# EAGLE design Fubarino_SD_v12 (EAGLE 5.10)
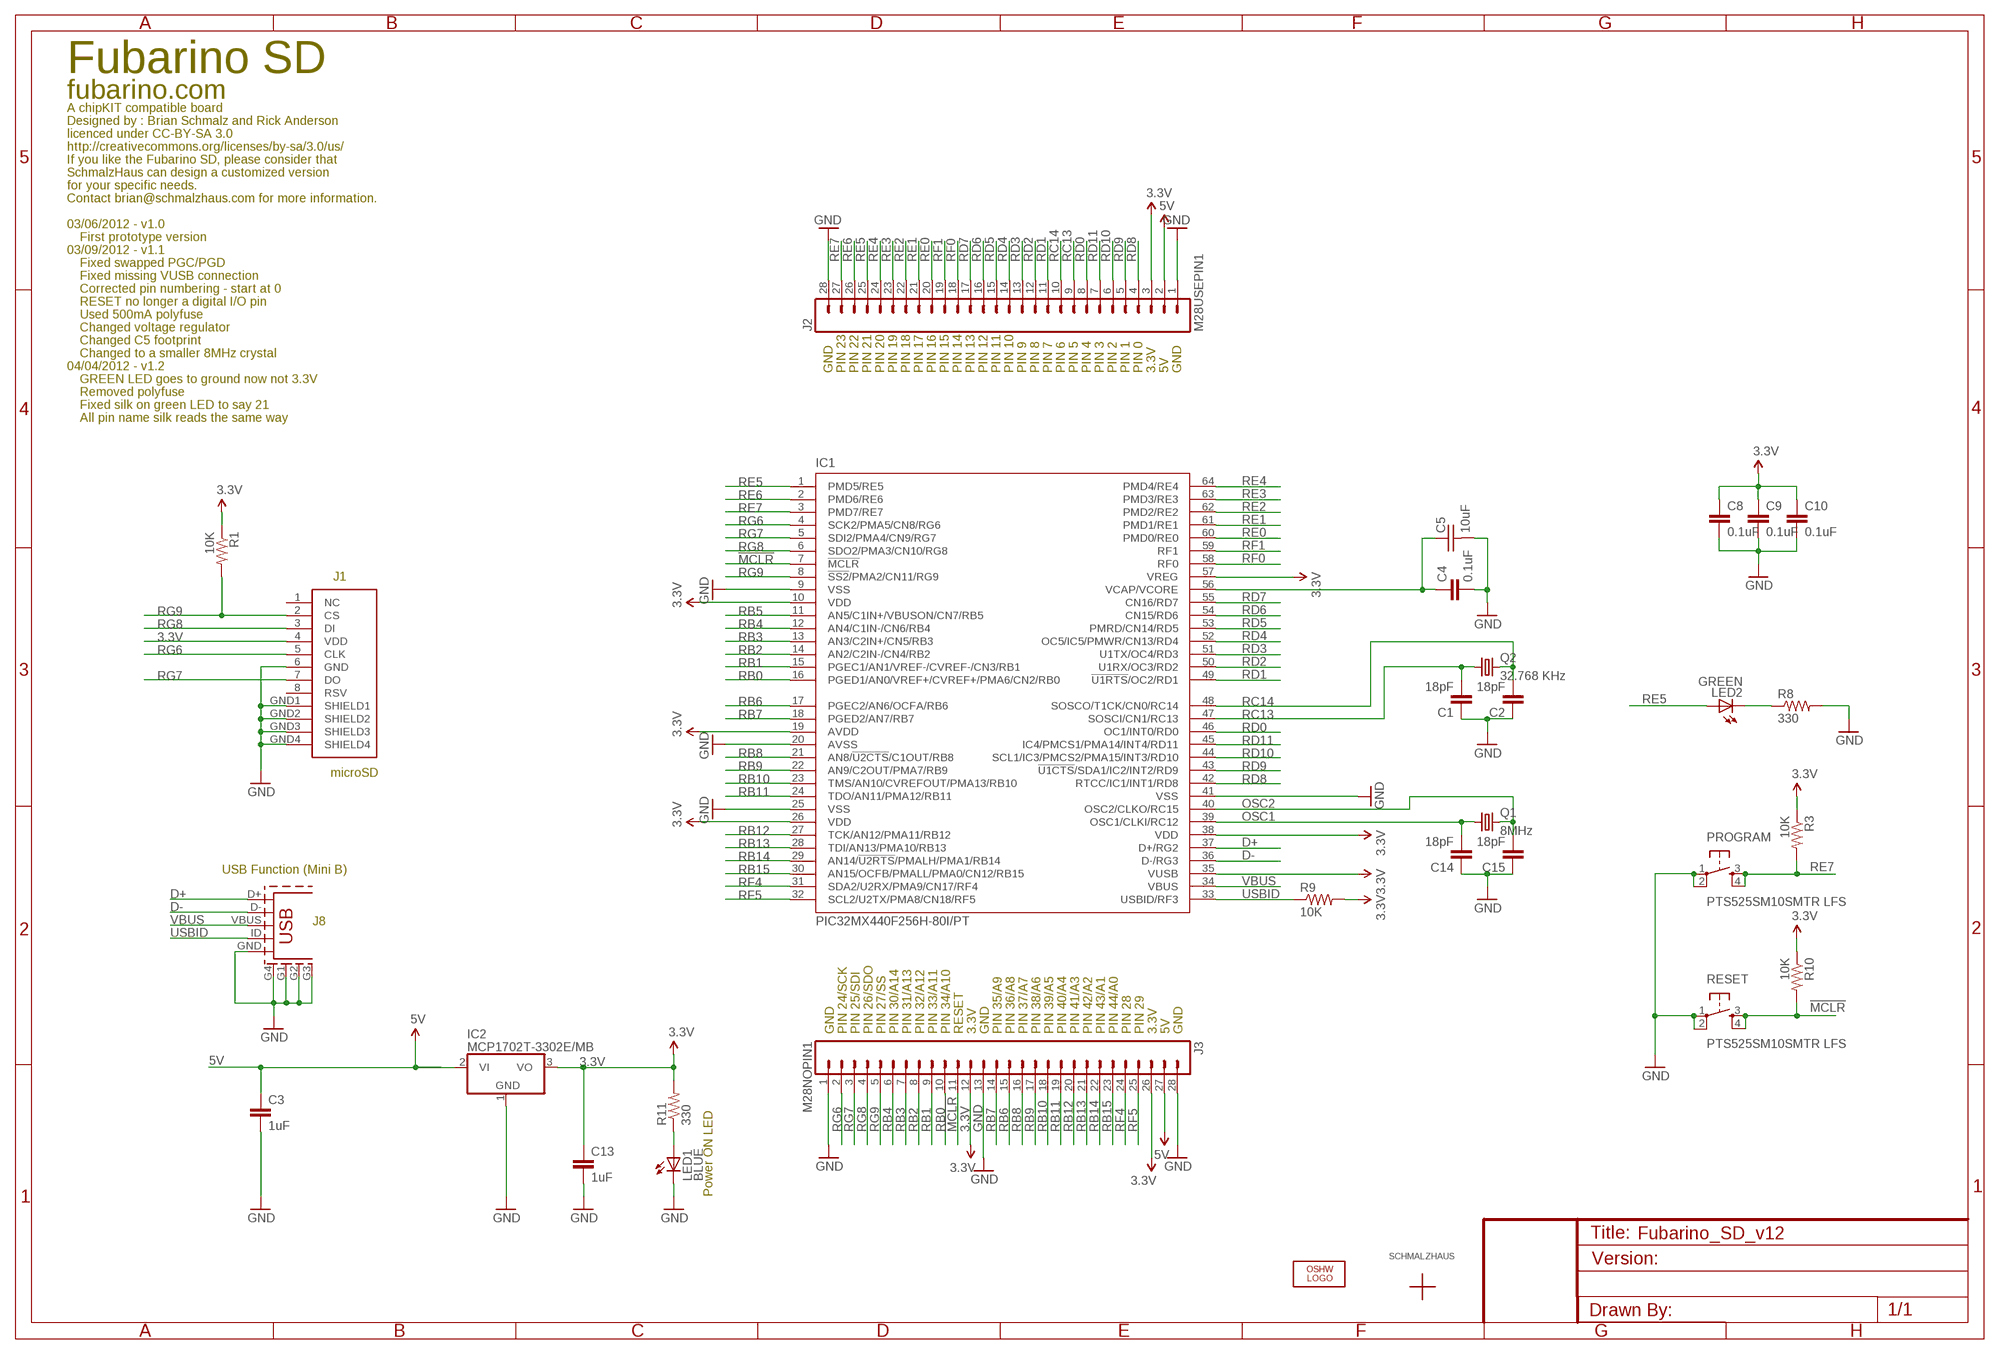
[diagram p0: schematic, sheet 1]

## Parts
C1  18pF  CAP0603-CAP  [0603-CAP]
C2  18pF  CAP0603-CAP  [0603-CAP]
C3  1uF  CAP0603-CAP  [0603-CAP]
C4  0.1uF  CAP0603-CAP  [0603-CAP]
C5  10uF  CAP0805  [CAP_0805]
C8  0.1uF  CAP0603-CAP  [0603-CAP]
C9  0.1uF  CAP0603-CAP  [0603-CAP]
C10  0.1uF  CAP0603  [0603]
C13  1uF  CAP0603  [0603]
C14  18pF  CAP0603-CAP  [0603-CAP]
C15  18pF  CAP0603-CAP  [0603-CAP]
IC1  PIC32MX440F256H-80I/PT  PIC32MX440F256H  [TQFP64-10X10]
IC2  MCP1702T-3302E/MB  MCP170333MB  [SOT89]
J1  MICRO_SD_CARD_SOCKET  [SD-MMC_SOCKET-PP]
J2  M28USEPIN1  [1X28]
J3  M28NOPIN1  [1X28_NO_PIN_1]
J8  UX60A-MB-5ST  USB_5PIN  [USB-MINIB]
LED1  BLUE  LED0603  [LED-0603]
LED2  GREEN  LED0603  [LED-0603]
LOGO1  OSHW_LOGO_8MILX0070-NT  [OSHW_8X70_NOTEXT]
PROGRAM  PTS525SM10SMTR LFS  TAC_SWITCHSND  [TACTILE_SWITCH_SMD]
Q1  8MHz  CRYSTALNX5032  [NX5032_5MM_3.2MM_CRYSTAL]
Q2  32.768 KHz  CRYSTALTC26H  [TC26H]
R1  10K  RESISTOR0603-RES  [0603-RES]
R3  10K  RESISTOR0603-RES  [0603-RES]
R8  330  RESISTOR0603-RES  [0603-RES]
R9  10K  RESISTOR0603-RES  [0603-RES]
R10  10K  RESISTOR0603-RES  [0603-RES]
R11  330  RESISTOR0603-RES  [0603-RES]
RESET  PTS525SM10SMTR LFS  TAC_SWITCHSND  [TACTILE_SWITCH_SMD]
U$1  SCHMALZHAUSSCHMALZHAUS_SMALL  [SCHMALZHAUS_SMALL]

## Nets
3.3V: C8.1 C9.1 C10.1 C13.1 IC1.10(VDD) IC1.19(AVDD) IC1.26(VDD) IC1.35(VUSB) IC1.38(VDD) IC1.57(VREG) IC2.3(VO) J1.4(VDD) J2.3 J3.12 J3.26 R1.1 R3.1 R9.2 R10.1 R11.2
5V: C3.1 IC2.2(VI) IC2.2@1(VI1) J2.2 J3.27
!MCLR!: IC1.7(!MCLR) J3.11 R10.2 RESET.3 RESET.4
D+: IC1.37(D+/RG2) J8.D+
D-: IC1.36(D-/RG3) J8.D-
GND: C1.1 C2.1 C3.2 C4.2 C5.2 C8.2 C9.2 C10.2 C13.2 C14.1 C15.1 IC1.9(VSS) IC1.20(AVSS) IC1.25(VSS) IC1.41(VSS) IC2.1(GND) J1.6(GND) J1.GND1(SHIELD1) J1.GND2(SHIELD2) J1.GND3(SHIELD3) J1.GND4(SHIELD4) J2.1 J2.28 J3.1 J3.13 J3.28 J8.G1 J8.G2 J8.G3 J8.G4(SHIELD) J8.GND LED1.C PROGRAM.1 PROGRAM.2 R8.2 RESET.1 RESET.2
N$6: LED1.A R11.1
N$20: LED2.C R8.1
N$110: C4.1 C5.1 IC1.56(VCAP/VCORE)
OSC1: C14.2 IC1.39(OSC1/CLKI/RC12) Q1.1
OSC2: C15.2 IC1.40(OSC2/CLKO/RC15) Q1.2
RB0: IC1.16(PGED1/AN0/VREF+/CVREF+/PMA6/CN2/RB0) J3.10
RB1: IC1.15(PGEC1/AN1/VREF-/CVREF-/CN3/RB1) J3.9
RB2: IC1.14(AN2/C2IN-/CN4/RB2) J3.8
RB3: IC1.13(AN3/C2IN+/CN5/RB3) J3.7
RB4: IC1.12(AN4/C1IN-/CN6/RB4) J3.6
RB5: IC1.11(AN5/C1IN+/VBUSON/CN7/RB5)
RB6: IC1.17(PGEC2/AN6/OCFA/RB6) J3.15
RB7: IC1.18(PGED2/AN7/RB7) J3.14
RB8: IC1.21(AN8/!U2CTS!/C1OUT/RB8) J3.16
RB9: IC1.22(AN9/C2OUT/PMA7/RB9) J3.17
RB10: IC1.23(TMS/AN10/CVREFOUT/PMA13/RB10) J3.18
RB11: IC1.24(TDO/AN11/PMA12/RB11) J3.19
RB12: IC1.27(TCK/AN12/PMA11/RB12) J3.20
RB13: IC1.28(TDI/AN13/PMA10/RB13) J3.21
RB14: IC1.29(AN14/!U2RTS!/PMALH/PMA1/RB14) J3.22
RB15: IC1.30(AN15/OCFB/PMALL/PMA0/CN12/RB15) J3.23
RC13: C1.2 IC1.47(SOSCI/CN1/RC13) J2.9 Q2.1
RC14: C2.2 IC1.48(SOSCO/T1CK/CN0/RC14) J2.10 Q2.2
RD0: IC1.46(OC1/INT0/RD0) J2.8
RD1: IC1.49(!U1RTS!/OC2/RD1) J2.11
RD2: IC1.50(U1RX/OC3/RD2) J2.12
RD3: IC1.51(U1TX/OC4/RD3) J2.13
RD4: IC1.52(OC5/IC5/PMWR/CN13/RD4) J2.14
RD5: IC1.53(PMRD/CN14/RD5) J2.15
RD6: IC1.54(CN15/RD6) J2.16
RD7: IC1.55(CN16/RD7) J2.17
RD8: IC1.42(RTCC/IC1/INT1/RD8) J2.4
RD9: IC1.43(!U1CTS!/SDA1/IC2/INT2/RD9) J2.5
RD10: IC1.44(SCL1/IC3/PMCS2/PMA15/INT3/RD10) J2.6
RD11: IC1.45(IC4/PMCS1/PMA14/INT4/RD11) J2.7
RE0: IC1.60(PMD0/RE0) J2.20
RE1: IC1.61(PMD1/RE1) J2.21
RE2: IC1.62(PMD2/RE2) J2.22
RE3: IC1.63(PMD3/RE3) J2.23
RE4: IC1.64(PMD4/RE4) J2.24
RE5: IC1.1(PMD5/RE5) J2.25 LED2.A
RE6: IC1.2(PMD6/RE6) J2.26
RE7: IC1.3(PMD7/RE7) J2.27 PROGRAM.3 PROGRAM.4 R3.2
RF0: IC1.58(RF0) J2.18
RF1: IC1.59(RF1) J2.19
RF4: IC1.31(SDA2/U2RX/PMA9/CN17/RF4) J3.24
RF5: IC1.32(SCL2/U2TX/PMA8/CN18/RF5) J3.25
RG6: IC1.4(SCK2/PMA5/CN8/RG6) J1.5(CLK) J3.2
RG7: IC1.5(SDI2/PMA4/CN9/RG7) J1.7(DO) J3.3
RG8: IC1.6(SDO2/PMA3/CN10/RG8) J1.3(DI) J3.4
RG9: IC1.8(!SS2!/PMA2/CN11/RG9) J1.2(CS) J3.5 R1.2
USBID: IC1.33(USBID/RF3) J8.ID(USB_ID) R9.1
VBUS: IC1.34(VBUS) J8.VBUS
Unconnected: J1.1(NC) J1.8(RSV)

## Notes on the sheet
- Fubarino SD
- fubarino.com
- A chipKIT compatible board
- Designed by : Brian Schmalz and Rick Anderson
- licenced under CC-BY-SA 3.0
- http://creativecommons.org/licenses/by-sa/3.0/us/
- If you like the Fubarino SD, please consider that
- SchmalzHaus can design a customized version
- for your specific needs.
- Contact brian@schmalzhaus.com for more information.
- 03/06/2012 - v1.0
- First prototype version
- 03/09/2012 - v1.1
- Fixed swapped PGC/PGD
- Fixed missing VUSB connection
- Corrected pin numbering - start at 0
- RESET no longer a digital I/O pin
- Used 500mA polyfuse
- Changed voltage regulator
- Changed C5 footprint
- Changed to a smaller 8MHz crystal
- 04/04/2012 - v1.2 | GND | PIN 23 | PIN 22 | PIN 21 | PIN 20 | PIN 19 | PIN 18 | PIN 17 | PIN 16 | PIN 15 | PIN 14 | PIN 13 | PIN 12 | PIN 11 | PIN 10 | PIN 9 | PIN 8 | PIN 7 | PIN 6 | PIN 5 | PIN 4 | PIN 3 | PIN 2 | PIN 1 | PIN 0 | 3.3V | 5V | GND
- GREEN LED goes to ground now not 3.3V
- Removed polyfuse
- Fixed silk on green LED to say 21
- All pin name silk reads the same way
- J1
- microSD
- USB Function (Mini B)
- J8
- GND | PIN 24/SCK | PIN 25/SDI | PIN 26/SDO | PIN 27/SS | PIN 30/A14 | PIN 31/A13 | PIN 32/A12 | PIN 33/A11 | PIN 34/A10 | RESET | 3.3V | GND | PIN 35/A9 | PIN 36/A8 | PIN 37/A7 | PIN 38/A6 | PIN 39/A5 | PIN 40/A4 | PIN 41/A3 | PIN 42/A2 | PIN 43/A1 | PIN 44/A0 | PIN 28 | PIN 29 | 3.3V | 5V | GND
- Power ON LED

## Library data of the parts
C1-C4 C8 C9 C14 C15 = SparkFun:CAP: Capacitor Standard 0603 ceramic capacitor, and 0.1" leaded capacitor.
C5 = SchmalzHaus:CAP
C10 C13 = SparkFun02-20-08:CAP: Capacitor Standard 0603 ceramic capacitor, and 0.1" leaded capacitor.
IC1 = SchmalzHaus:PIC32MX440F256H: PIC32MX440F256H edit this description Auto generated by make-symbol-device-package-bsdl.ulp Rev. 25 Source: PIC32MX440F256H.bsdl
IC2 = linear:MCP1703*: 250 mA, 16V, Low Quiescent Current LDO Regulator Source: http://ww1.microchip.com/downloads/en/DeviceDoc/22049b.pdf
J1 = SchmalzHaus:MICRO_SD_CARD_SOCKET: SD/MMC Socket Media socket for SD and MMC cards. Push-push type. Schematic element and footprint production proven. Spark Fun Electronics SKU : PRT-00136
J2 J3 = SchmalzHaus:M28
J8 = SparkFun02-20-08:USB_5PIN
LED1 LED2 = SparkFun:LED: LEDs Standard schematic elements and footprints for 5mm, 3mm, 1206, and 0603 sized LEDs. 5mm - Spark Fun Electronics SKU : COM-00529 (and others)
LOGO1 = OSHW:OSHW_LOGO_8MIL
PROGRAM RESET = SparkFun02-20-08:TAC_SWITCH: Momentary Switch Button commonly used for reset or general input. Spark Fun Electronics SKU : COM-00097
Q1 = SchmalzHaus:CRYSTAL: Crystals Various standard crystals. Proven footprints. Spark Fun Electronics SKU : COM-00534
Q2 = SparkFun-12-01-09:CRYSTAL: Crystals Various standard crystals. Proven footprints. Spark Fun Electronics SKU : COM-00534
R1 R3 R8-R11 = SparkFun:RESISTOR: Resistor Basic schematic elements and footprints for 0603, 1206, and PTH resistors.
U$1 = SchmalzHaus:SCHMALZHAUS

## Board
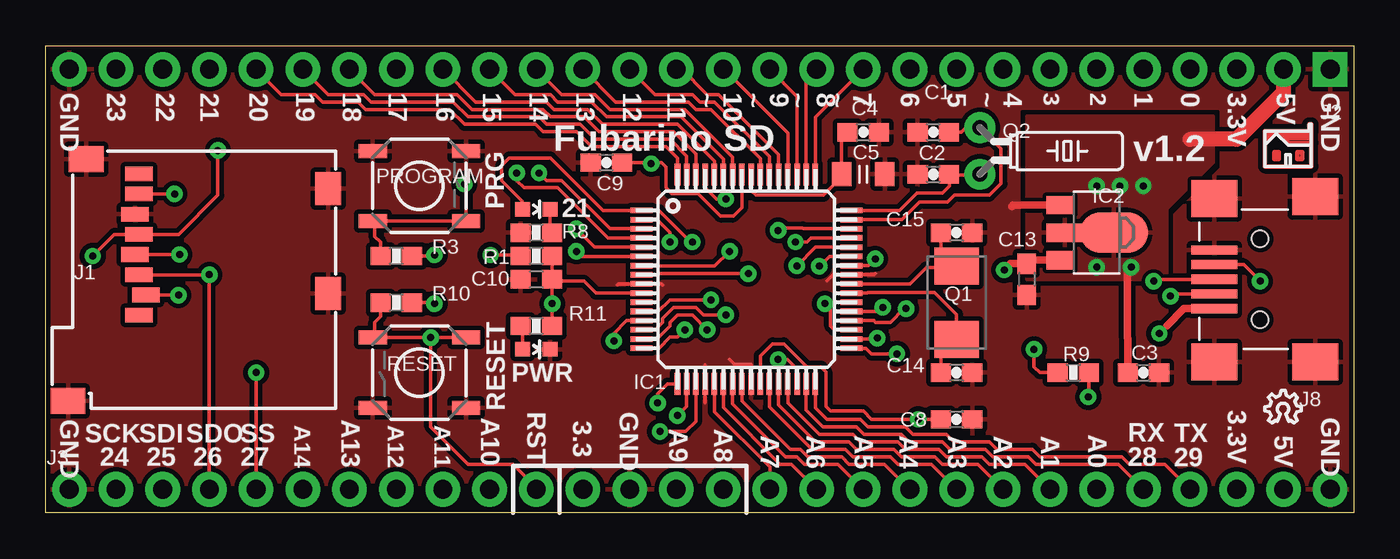
[diagram p1: board, top side]
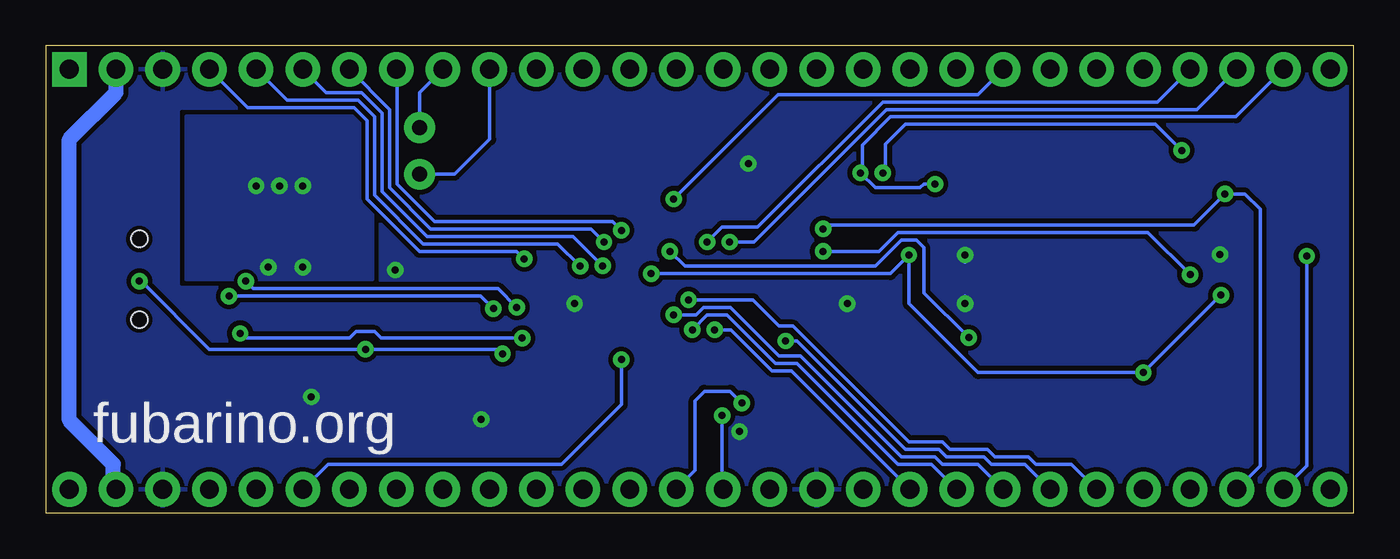
[diagram p2: board, bottom side, seen from below]

Size 71.12 x 25.4 mm. Coordinates in mm from the lower left corner, seen from the top.
Outline: 0,25.4 71.12,25.4 71.12,0 0,0 0,25.4
Copper layers (1*16): Top 0.035mm / dielectric 1.5mm / Bottom 0.035mm
Design rules "GoldPhoenix_8and8": minimum track width 7mil, minimum drill 15mil, track to track 8mil, track to pad 8mil, pad to pad 8mil, via to via 8mil, smd to smd 8mil, copper to edge 10mil, drill to drill 8mil, minimum pad ring 12mil, minimum via ring 10mil, stop-mask expansion 4mil, vias tented up to drill 25mil, thermal gap 10mil

### Footprints (pad centres in the part's own frame; a part is rotated, then mirrored left to right if it is on the bottom)
0603-CAP = smd 1.1 x 1: 1 -0.85,0; 2 0.85,0
CAP_0805 = smd 1.05 x 1.3: 1 -1.175,0; 2 1.175,0
0603 = smd 1.1 x 1: 1 -0.85,0; 2 0.85,0
TQFP64-10X10 = smd 1.2 x 0.3: 1 -5.7,3.75; 2 -5.7,3.25; 3 -5.7,2.75; 4 -5.7,2.25; 5 -5.7,1.75; 6 -5.7,1.25; 7 -5.7,0.75; 8 -5.7,0.25; 9 -5.7,-0.25; 10 -5.7,-0.75; 11 -5.7,-1.25; 12 -5.7,-1.75; 13 -5.7,-2.25; 14 -5.7,-2.75; 15 -5.7,-3.25; 16 -5.7,-3.75; 33 5.7,-3.75; 34 5.7,-3.25; 35 5.7,-2.75; 36 5.7,-2.25; 37 5.7,-1.75; 38 5.7,-1.25; 39 5.7,-0.75; 40 5.7,-0.25; 41 5.7,0.25; 42 5.7,0.75; 43 5.7,1.25; 44 5.7,1.75; 45 5.7,2.25; 46 5.7,2.75; 47 5.7,3.25; 48 5.7,3.75 | smd 0.3 x 1.2: 17 -3.75,-5.7; 18 -3.25,-5.7; 19 -2.75,-5.7; 20 -2.25,-5.7; 21 -1.75,-5.7; 22 -1.25,-5.7; 23 -0.75,-5.7; 24 -0.25,-5.7; 25 0.25,-5.7; 26 0.75,-5.7; 27 1.25,-5.7; 28 1.75,-5.7; 29 2.25,-5.7; 30 2.75,-5.7; 31 3.25,-5.7; 32 3.75,-5.7; 49 3.75,5.7; 50 3.25,5.7; 51 2.75,5.7; 52 2.25,5.7; 53 1.75,5.7; 54 1.25,5.7; 55 0.75,5.7; 56 0.25,5.7; 57 -0.25,5.7; 58 -0.75,5.7; 59 -1.25,5.7; 60 -1.75,5.7; 61 -2.25,5.7; 62 -2.75,5.7; 63 -3.25,5.7; 64 -3.75,5.7
SOT89 = smd 1 x 1.5: 1 -1.499,-1.981; 3 1.499,-1.981 | smd 1 x 2: 2 0,-1.727 | smd 2.2 x 3.7: 2@1 0,0.94
SD-MMC_SOCKET-PP = smd 0.8 x 1.5: 1 -8.94,10.7; 2 -7.84,10.3; 3 -6.74,10.7; 4 -5.64,10.9; 5 -4.54,10.7; 6 -3.44,10.9; 7 -2.34,10.7; 8 -1.24,10.7 | smd 1.4 x 1.9: GND1 -13.6,14.55; GND2 -0.45,13.55 | smd 1.8 x 1.4: GND3 -7.75,0.4; GND4 -2.05,0.4
1X28 = drill 1.016 pad 1.88 square: 1 0,0 | drill 1.016 pad 1.88 round: 2 2.54,0; 3 5.08,0; 4 7.62,0; 5 10.16,0; 6 12.7,0; 7 15.24,0; 8 17.78,0; 9 20.32,0; 10 22.86,0; 11 25.4,0; 12 27.94,0; 13 30.48,0; 14 33.02,0; 15 35.56,0; 16 38.1,0; 17 40.64,0; 18 43.18,0; 19 45.72,0; 20 48.26,0; 21 50.8,0; 22 53.34,0; 23 55.88,0; 24 58.42,0; 25 60.96,0; 26 63.5,0; 27 66.04,0; 28 68.58,0
1X28_NO_PIN_1 = drill 1.016 pad 1.88 round: 1 0,0; 2 2.54,0; 3 5.08,0; 4 7.62,0; 5 10.16,0; 6 12.7,0; 7 15.24,0; 8 17.78,0; 9 20.32,0; 10 22.86,0; 11 25.4,0; 12 27.94,0; 13 30.48,0; 14 33.02,0; 15 35.56,0; 16 38.1,0; 17 40.64,0; 18 43.18,0; 19 45.72,0; 20 48.26,0; 21 50.8,0; 22 53.34,0; 23 55.88,0; 24 58.42,0; 25 60.96,0; 26 63.5,0; 27 66.04,0; 28 68.58,0
USB-MINIB = smd 2.5 x 0.5: D+ 2.5,0; D- 2.5,0.8; GND 2.5,-1.6; ID 2.5,-0.8; VBUS 2.5,1.6 | smd 2.5 x 2: G1 -3,4.5; G2 2.5,4.5; G3 -3,-4.5; G4 2.5,-4.4 | hole 0.9: 0,2.2; 0,-2.2
LED-0603 = smd 0.8 x 0.8: A 0,-0.75; C 0,0.75
TACTILE_SWITCH_SMD = smd 1.524 x 0.762: 1 -2.54,1.905; 2 2.54,1.905; 3 -2.54,-1.905; 4 2.54,-1.905
NX5032_5MM_3.2MM_CRYSTAL = smd 2 x 2.4: 1 -2,0; 2 2,0
TC26H = drill 0.813 pad 1.676 round: 1 -1.27,0; 2 1.27,0
0603-RES = smd 1.1 x 1: 1 -0.85,0; 2 0.85,0

### Placement (x,y rotation side)
C1  48.26,20.7 0 top
C2  48.26,18.41 0 top
C3  59.69,7.62 0 top
C4  44.45,20.7 0 top
C5  44.45,18.41 0 top
C8  49.53,5.08 0 top
C9  30.48,19.05 180 top
C10  26.67,12.7 180 top
C13  53.34,12.7 270 top
C14  49.53,7.62 180 top
C15  49.53,15.24 180 top
IC1  38.1,12.7 0 top
IC2  57.15,15.24 270 top
J1  15.75,19.68 90 top
J2  69.85,24.13 180 top
J3  1.27,1.27 0 top
J8  66.04,12.7 180 top
LED1  26.67,8.89 270 top
LED2  26.67,16.51 270 top
LOGO1  66.29,4.88 0 top
PROGRAM  20.32,17.78 0 top
Q1  49.53,11.43 90 top
Q2  50.8,19.68 270 top
R1  26.67,13.97 180 top
R3  19.05,13.97 180 top
R8  26.67,15.24 180 top
R9  55.88,7.62 0 top
R10  19.05,11.43 180 top
R11  26.67,10.16 0 top
RESET  20.32,7.62 180 top
U$1  67.56,18.85 0 top

### Tracks (layer width: path | path; a pad name or v marks a point on that pad's centre or on a via)
3.3V  (via drill 0.38)
  Top 0.203: IC1.57 37.85,16.62 37.39,16.15 36.68,16.15 35.46,17.37 34.04,17.37 33.73,17.68 33.73,18.8 33.48,19.05 C9.1 | IC1.10 29.91,11.95 29.26,12.6 27.62,12.6 | 27.62,12.6 27.62,12.59 | R3.1 21.08,13.97 v21.13,14.02 | R10.1 21.08,11.43 v21.13,11.38 | J1.4 v7.26,14.04 v7.26,14.05 | 42.67,11.45 42.44,11.45 v42.37,11.38 | 42.67,11.45 IC1.38 | IC1.35 42.88,9.95 42.67,10.16 42.67,11.45 | IC1.26 38.86,7 38.86,8.53 39.52,9.2 40.13,9.2 41.4,7.92 42.16,7.92 42.42,7.67 42.42,5.79 42.67,5.54 44.45,5.54 44.91,5.08 v47.45,5.08 C8.1 | IC1.19 35.35,4.97 34.8,4.42 v33.4,4.42 | C10.1 R1.1 | C10.1 27.62,12.6 | R9.2 56.73,6.34 v56.69,6.3 | C10.1 27.53,12.69 v27.53,11.38 27.52,11.37 R11.2 | C9.1 31.38,19.1 | C9.1 32.87,19.05 v32.92,19
  Top 0.406: IC2.3 53.53,13.74 C13.1 52.46,13.55 v52.12,13.21
  Bottom 0.203: v21.13,14.02 21.13,13.61 | v21.13,11.38 21.13,11.79
  pour Bottom (isolate 0.254, rank 3): 0,0 0,25.4 71.12,25.4 71.12,0
5V  (via drill 0.38)
  Top 0.203: 58.84,9.49 58.83,9.5 | 58.83,13.16 v59.03,13.36
  Top 0.406: C3.1 58.84,9.49 | 58.83,9.5 58.83,13.16
  Top 0.813: J2.2 67.31,22.86 64.77,20.32 62.23,20.32
  Bottom 0.813: J2.2 67.31,22.86 69.85,20.32 69.85,5.03 67.46,2.64 67.46,1.42 J3.27
  other vias: 59.69,17.78 57.15,17.78 57.15,13.36 58.42,17.78
  pour Top: 63.5,21.59 53.34,21.59 53.34,12.7 60.96,12.7 60.96,16.51 63.5,19.05
  pour Bottom: 53.34,21.59 53.34,12.7 63.5,12.7 63.5,21.59
!MCLR!  (via drill 0.38)
  Top 0.203: R10.2 18.2,10.68 17.88,10.36 17.88,9.63 RESET.4 v20.93,9.53 | v37.19,14.22 36.37,13.41 33.22,13.41 33.18,13.45 IC1.7 | v20.93,9.53 RESET.3 | J3.11 26.67,1.37 25.4,2.64 22.96,2.64 20.93,4.67 v20.93,9.53
  Bottom 0.203: v37.19,14.22 36.37,13.41 26.01,13.41 24.59,14.83 23.77,14.83 23.37,14.43 23.37,11.96 v20.93,9.53
D+  (via drill 0.38)
  Top 0.203: J8.D+ 60.35,12.7 v60.25,12.6 | IC1.37 45.29,10.95 v45.52,11.18
  Bottom 0.203: v60.25,12.6 59.84,12.19 46.53,12.19 v45.52,11.18
D-  (via drill 0.38)
  Top 0.203: J8.D- 61.28,11.9 v61.16,11.79 | IC1.36 45.02,10.45 45.11,10.36 45.92,10.36 46.66,11.1 v46.79,11.1
  Bottom 0.203: v61.16,11.79 47.47,11.79 v46.79,11.1
GND
  Top 0.203: 45.11,13.01 45.06,12.95 IC1.41 42.82,12.95 42.47,12.6 | IC1.25 38.35,8.07 37.44,8.07 37.19,8.33 | 35.85,5.98 IC1.20 35.85,8.04 | 33.53,12.39 33.47,12.45 IC1.9 31.14,12.45 31.09,12.39
  Top 0.406: IC2.1 52.6,16.74 52.53,16.66
  pour Top (isolate 0.254, rank 4): 0,25.4 0,0 71.12,0 71.12,25.4
N$6
  Top 0.203: 25.82,10.06 R11.1 25.92,10.06 LED1.A
N$20
  Top 0.203: LED2.C 27.42,15.34 R8.1
N$110
  Top 0.203: IC1.56 38.35,17.53 38.61,17.27 42.29,17.27 42.93,17.91 42.93,18.07 C5.1 43.27,20.38 C4.1
OSC1
  Top 0.203: IC1.39 44.66,11.95 44.7,11.99 48.34,11.99 49.53,10.79 Q1.1 48.68,8.58 C14.2
OSC2
  Top 0.203: IC1.40 46.99,12.45 47.88,13.34 48.9,13.34 | 48.9,13.34 49.44,13.34 Q1.2 | C15.2 48.68,13.55 48.9,13.34
RB0  (via drill 0.38)
  Top 0.203: v34.75,9.96 34.35,9.56 33.94,9.56 33.33,8.95 IC1.16
  Bottom 0.203: J3.10 30.58,7.72 31.62,7.72 33.86,9.96 v34.75,9.96
RB1  (via drill 0.38)
  Top 0.203: IC1.15 33.22,9.45 33.93,10.16 33.93,10.36 34.34,10.77 35.15,10.77 v35.97,9.96
  Bottom 0.203: v35.97,9.96 35.15,10.77 34.09,10.77 31.45,8.13 30.28,8.13 24.79,2.64 22.96,2.64 J3.9
RB2  (via drill 0.38)
  Top 0.203: IC1.14 33.12,9.95 33.53,10.36 33.53,10.57 34.14,11.18 35.36,11.18 35.76,10.77 v36.98,10.77
  Bottom 0.203: v36.98,10.77 35.76,10.77 35.36,11.18 33.88,11.18 31.24,8.53 30.07,8.53 24.59,3.05 22.76,3.05 22.35,2.64 20.42,2.64 J3.8
RB3  (via drill 0.38)
  Top 0.203: IC1.13 31.58,10.45 30.89,9.75 v30.89,9.35
  Bottom 0.203: J3.7 17.88,2.64 19.71,2.64 20.12,3.05 22.15,3.05 22.55,3.45 24.38,3.45 30.28,9.35 v30.89,9.35
RB4  (via drill 0.38)
  Top 0.203: IC1.12 33.3,10.95 33.93,11.58 v36.17,11.58
  Bottom 0.203: v36.17,11.58 32.66,11.58 31.24,10.16 30.48,10.16 24.18,3.86 22.35,3.86 21.95,3.45 19.91,3.45 19.51,3.05 17.68,3.05 17.27,2.64 15.34,2.64 J3.6
RB6  (via drill 0.38)
  Top 0.203: IC1.17 33.8,7 33.27,6.48 v33.27,5.97
  Bottom 0.203: J3.15 36.83,1.29 35.81,2.31 35.81,6.1 35.31,6.6 33.91,6.6 v33.27,5.97
RB7  (via drill 0.38)
  Top 0.203: IC1.18 34.85,5.79 v34.34,5.28
  Bottom 0.203: v34.34,5.28 34.34,1.32 J3.14
RB8
  Top 0.203: IC1.21 36.35,5.51 36.37,5.49 39.37,2.49 J3.16
RB9
  Top 0.203: IC1.22 36.85,5.72 39.93,2.64 40.54,2.64 J3.17
RB10
  Top 0.203: IC1.23 37.35,5.93 40.23,3.05 40.84,3.05 41.25,2.64 43.08,2.64 J3.18
RB11
  Top 0.203: IC1.24 37.85,6.09 40.49,3.45 41.05,3.45 41.45,3.05 43.28,3.05 43.69,2.64 45.62,2.64 J3.19
RB12
  Top 0.203: J3.20 48.16,2.64 46.33,2.64 45.92,3.05 43.89,3.05 43.48,3.45 41.66,3.45 39.35,5.76 IC1.27
RB13
  Top 0.203: IC1.28 39.85,5.87 41.86,3.86 43.69,3.86 44.09,3.45 46.13,3.45 46.53,3.05 48.36,3.05 48.77,2.64 50.7,2.64 J3.21
RB14
  Top 0.203: J3.22 53.24,2.64 51.31,2.64 50.9,3.05 48.97,3.05 48.56,3.45 46.74,3.45 46.33,3.86 44.3,3.86 43.89,4.27 42.06,4.27 40.35,5.98 IC1.29
RB15  (via drill 0.38)
  Top 0.203: v39.83,8.33 40.34,8.33 40.85,7.82 IC1.30
  Bottom 0.203: v39.83,8.33 39.83,5.89 43.08,2.64 55.78,2.64 J3.23
RC13
  Top 0.203: IC1.47 46.56,15.95 47.5,16.89 49.02,16.89 49.4,17.27 51.31,17.27 51.94,17.91 51.94,19.81 Q2.1 50.04,20.95 49.78,20.7 C1.2
  Bottom 0.203: Q2.1 50.8,22.86 J2.9
RC14
  Top 0.203: IC1.48 46.42,16.45 47.37,17.4 48.77,17.4 49.15,17.78 49.15,18.38 | 49.15,18.38 C2.2 | 49.15,18.38 50.76,18.38 Q2.2
  Bottom 0.203: Q2.2 48.9,18.41 46.99,20.32 J2.10
RD0  (via drill 0.38)
  Top 0.203: IC1.46 41.19,15.45 41.15,15.49 39.95,15.49 v39.83,15.37
  Bottom 0.203: J2.8 52.02,24.08 52.02,17.88 49.99,15.85 40.31,15.85 v39.83,15.37
RD1
  Top 0.203: IC1.49 41.85,21.53 J2.11
RD2
  Top 0.203: IC1.50 41.35,23.57 J2.12
RD3
  Top 0.203: IC1.51 40.85,22.65 J2.13
RD4
  Top 0.203: IC1.52 40.35,20.66 36.93,24.08 36.88,24.08 J2.14
RD5
  Top 0.203: IC1.53 39.85,19.48 36.58,22.76 35.97,22.76 34.54,24.18 34.24,24.18 J2.15
RD6
  Top 0.203: IC1.54 39.35,19.38 36.37,22.35 35.56,22.35 35.15,22.76 33.12,22.76 J2.16
RD7
  Top 0.203: IC1.55 38.85,19.27 36.17,21.95 35.36,21.95 34.95,22.35 30.99,22.35 J2.17
RD8  (via drill 0.38)
  Top 0.203: IC1.42 44.74,13.45 v45.11,13.82
  Bottom 0.203: v45.11,13.82 45.52,14.22 50.8,14.22 53.65,17.07 53.65,21.34 54.36,22.05 60.15,22.05 J2.4
RD9  (via drill 0.38)
  Top 0.203: IC1.43 42.6,13.95 v42.06,13.41
  Bottom 0.203: J2.5 58.01,22.45 54.15,22.45 53.24,21.54 53.24,17.27 50.6,14.63 43.28,14.63 v42.06,13.41
RD10  (via drill 0.38)
  Top 0.203: IC1.44 41.86,14.45 v40.84,13.44
  Bottom 0.203: 57.1,24.08 J2.6 55.88,22.86 53.95,22.86 52.83,21.74 52.83,17.48 50.39,15.04 42.44,15.04 v40.84,13.44
RD11  (via drill 0.38)
  Top 0.203: IC1.45 41.62,14.95 41.4,14.73 v40.77,14.73
  Bottom 0.203: J2.7 52.43,21.95 52.43,17.68 50.19,15.44 41.48,15.44 v40.77,14.73
RE0
  Top 0.203: IC1.60 36.35,19.12 34.34,21.13 30.28,21.13 29.46,21.95 27.64,21.95 27.23,22.35 23.37,22.35 J2.20
RE1  (via drill 0.38)
  Top 0.203: IC1.61 35.85,17.69 36.47,17.07 v36.98,17.07
  Bottom 0.203: v36.98,17.07 31.29,22.76 20.42,22.76 J2.21
RE2
  Top 0.203: IC1.62 35.35,19.51 34.14,20.73 30.07,20.73 29.26,21.54 27.43,21.54 27.03,21.95 23.16,21.95 22.35,22.76 17.88,22.76 J2.22
RE3
  Top 0.203: IC1.63 34.85,19.4 33.93,20.32 29.87,20.32 29.06,21.13 27.23,21.13 26.82,21.54 22.96,21.54 22.15,22.35 17.68,22.35 17.27,22.76 15.34,22.76 J2.23
RE4
  Top 0.203: IC1.64 34.35,19.3 33.73,19.91 29.67,19.91 28.85,20.73 27.03,20.73 26.62,21.13 22.76,21.13 21.95,21.95 17.37,21.95 16.97,22.35 15.04,22.35 14.63,22.76 12.8,22.76 J2.24
RE5  (via drill 0.38)
  Top 0.203: v35.15,14.73 35.05,14.73 33.33,16.45 IC1.1 30.29,16.45 27.43,19.3 25.2,19.3 24.79,18.9 24.79,18.09 25.91,16.97 25.91,16.52 LED2.A
  Bottom 0.203: v35.15,14.73 34.34,15.54 32.41,15.54 25.6,22.35 10.67,22.35 J2.25
RE6  (via drill 0.38)
  Top 0.203: IC1.2 33.22,15.95 33.93,15.24 v33.93,14.73
  Bottom 0.203: v33.93,14.73 32.61,14.73 25.4,21.95 8.53,21.95 J2.26
RE7  (via drill 0.38)
  Top 0.203: R3.2 18.2,14.72 17.88,15.04 17.88,15.77 PROGRAM.3 PROGRAM.4 22.86,17.78 v22.76,17.88 | IC1.3 30.68,15.45 28.04,18.09 27.23,18.09 v26.82,18.49
  Bottom 0.203: v22.76,17.88 23.37,17.88 23.57,17.68 26.01,17.68 v26.82,18.49 26.72,18.59 26.72,20.02 25.2,21.54 6.4,21.54 J2.27
RF0
  Top 0.203: IC1.58 37.35,19.34 34.75,21.95 30.68,21.95 29.87,22.76 28.04,22.76 J2.18
RF1
  Top 0.203: IC1.59 36.85,19.23 34.54,21.54 30.48,21.54 29.67,22.35 27.84,22.35 27.43,22.76 25.5,22.76 J2.19
RF4
  Top 0.203: J3.24 58.32,2.64 53.85,2.64 53.44,3.05 51.51,3.05 51.1,3.45 49.17,3.45 48.77,3.86 46.94,3.86 46.53,4.27 44.5,4.27 44.09,4.67 42.27,4.67 41.35,5.59 IC1.31
RF5
  Top 0.203: IC1.32 41.85,5.7 42.47,5.08 44.3,5.08 44.7,4.67 46.74,4.67 47.14,4.27 48.97,4.27 49.38,3.86 51.31,3.86 51.71,3.45 53.65,3.45 54.05,3.05 58.52,3.05 58.93,2.64 60.86,2.64 J3.25
RG6  (via drill 0.38)
  Top 0.203: v9.35,19.71 9.35,17.27 7.22,15.14 J1.5 3.71,15.14 v2.54,13.97 | IC1.4 30.57,14.95 27.84,17.68 26.01,17.68 25.6,18.09 v25.6,18.49
  Bottom 0.203: v9.35,19.71 10.77,21.13 24.38,21.13 25.45,20.07 25.45,18.64 v25.6,18.49 | v2.54,13.97 2.54,2.54 J3.2
RG7  (via drill 0.38)
  Top 0.203: IC1.5 29.85,14.45 v28.85,15.44 | J1.7 5.99,17.34 v6.99,17.34
  Bottom 0.203: v28.85,15.44 28.65,15.65 8.69,15.65 v6.99,17.34 5.92,17.34 5.08,16.51 5.08,2.54 J3.3
RG8  (via drill 0.38)
  Top 0.203: IC1.6 29.13,13.95 v28.85,14.22 | J3.4 v8.89,12.95 v8.88,12.95 J1.3
  Bottom 0.203: v28.85,14.22 25.81,14.22 24.79,15.24 11.18,15.24 v8.89,12.95
RG9  (via drill 0.38)
  Top 0.203: IC1.8 33.27,12.95 33.33,13.01 v38.2,13.01 | v24.18,14.02 25.77,14.02 R1.2 | J3.5 v11.43,7.62 | J1.2 v7.21,11.85 v7.21,11.84
  Bottom 0.203: v38.2,13.01 25.2,13.01 v24.18,14.02 24.18,11.38 20.42,7.62 v11.43,7.62 v7.21,11.84
USBID  (via drill 0.38)
  Top 0.203: J8.ID 65.14,13.5 v66.04,12.6 | IC1.33 44.59,8.95 44.91,8.64 46.28,8.64 v46.29,8.65 | R9.1 54.05,7.62 53.75,7.92 v53.75,8.89
  Bottom 0.203: v66.04,12.6 65.94,12.6 62.23,8.89 v53.75,8.89 53.24,8.89 46.53,8.89 v46.29,8.65
VBUS  (via drill 0.38)
  Top 0.203: v60.55,9.75 60.96,10.16 | IC1.34 45.16,9.45 v45.21,9.5
  Top 0.406: J8.VBUS 61.9,11.1 60.96,10.16
  Bottom 0.203: v60.55,9.75 60.3,9.5 54.61,9.5 54.25,9.86 53.24,9.86 52.88,9.5 v45.21,9.5

### Text on the board
tPlace: GND | 23 | 22 | 21 | 20 | 19 | 18 | 17 | 16 | 15 | 14 | 13 | 12 | 11 | ~ | 10 | ~ | 9 | ~ | 8 | ~ | 7 | 6 | 5 | ~ | 4 | 3 | 2 | 1 | 0 | 3.3V | 5V | GND | Fubarino SD | v1.2 | PRG | 21 | PWR | RESET | RST | 3.3V | GND | A14 | A13 | A12 | A11 | A10 | 3.3 | GND | A9 | A8 | GND | SCK | SDI | SDO | SS | A7 | A6 | A5 | A4 | A3 | A2 | A1 | A0 | RX | TX | 5V | 24 | 25 | 26 | 27 | 28 | 29
bPlace: fubarino.org